# EasyEDA Pro project Remote_Board.eprj

# Schematic Schematic1
Board Name: Board1; Create Date: 2026-01-31; Page Name: P1; Project Name: Remote_Board; Schematic Name: Schematic1; Update Date: 2026-02-01; Company: 嘉立创EDA; Page Size: A4; Version: V1.0
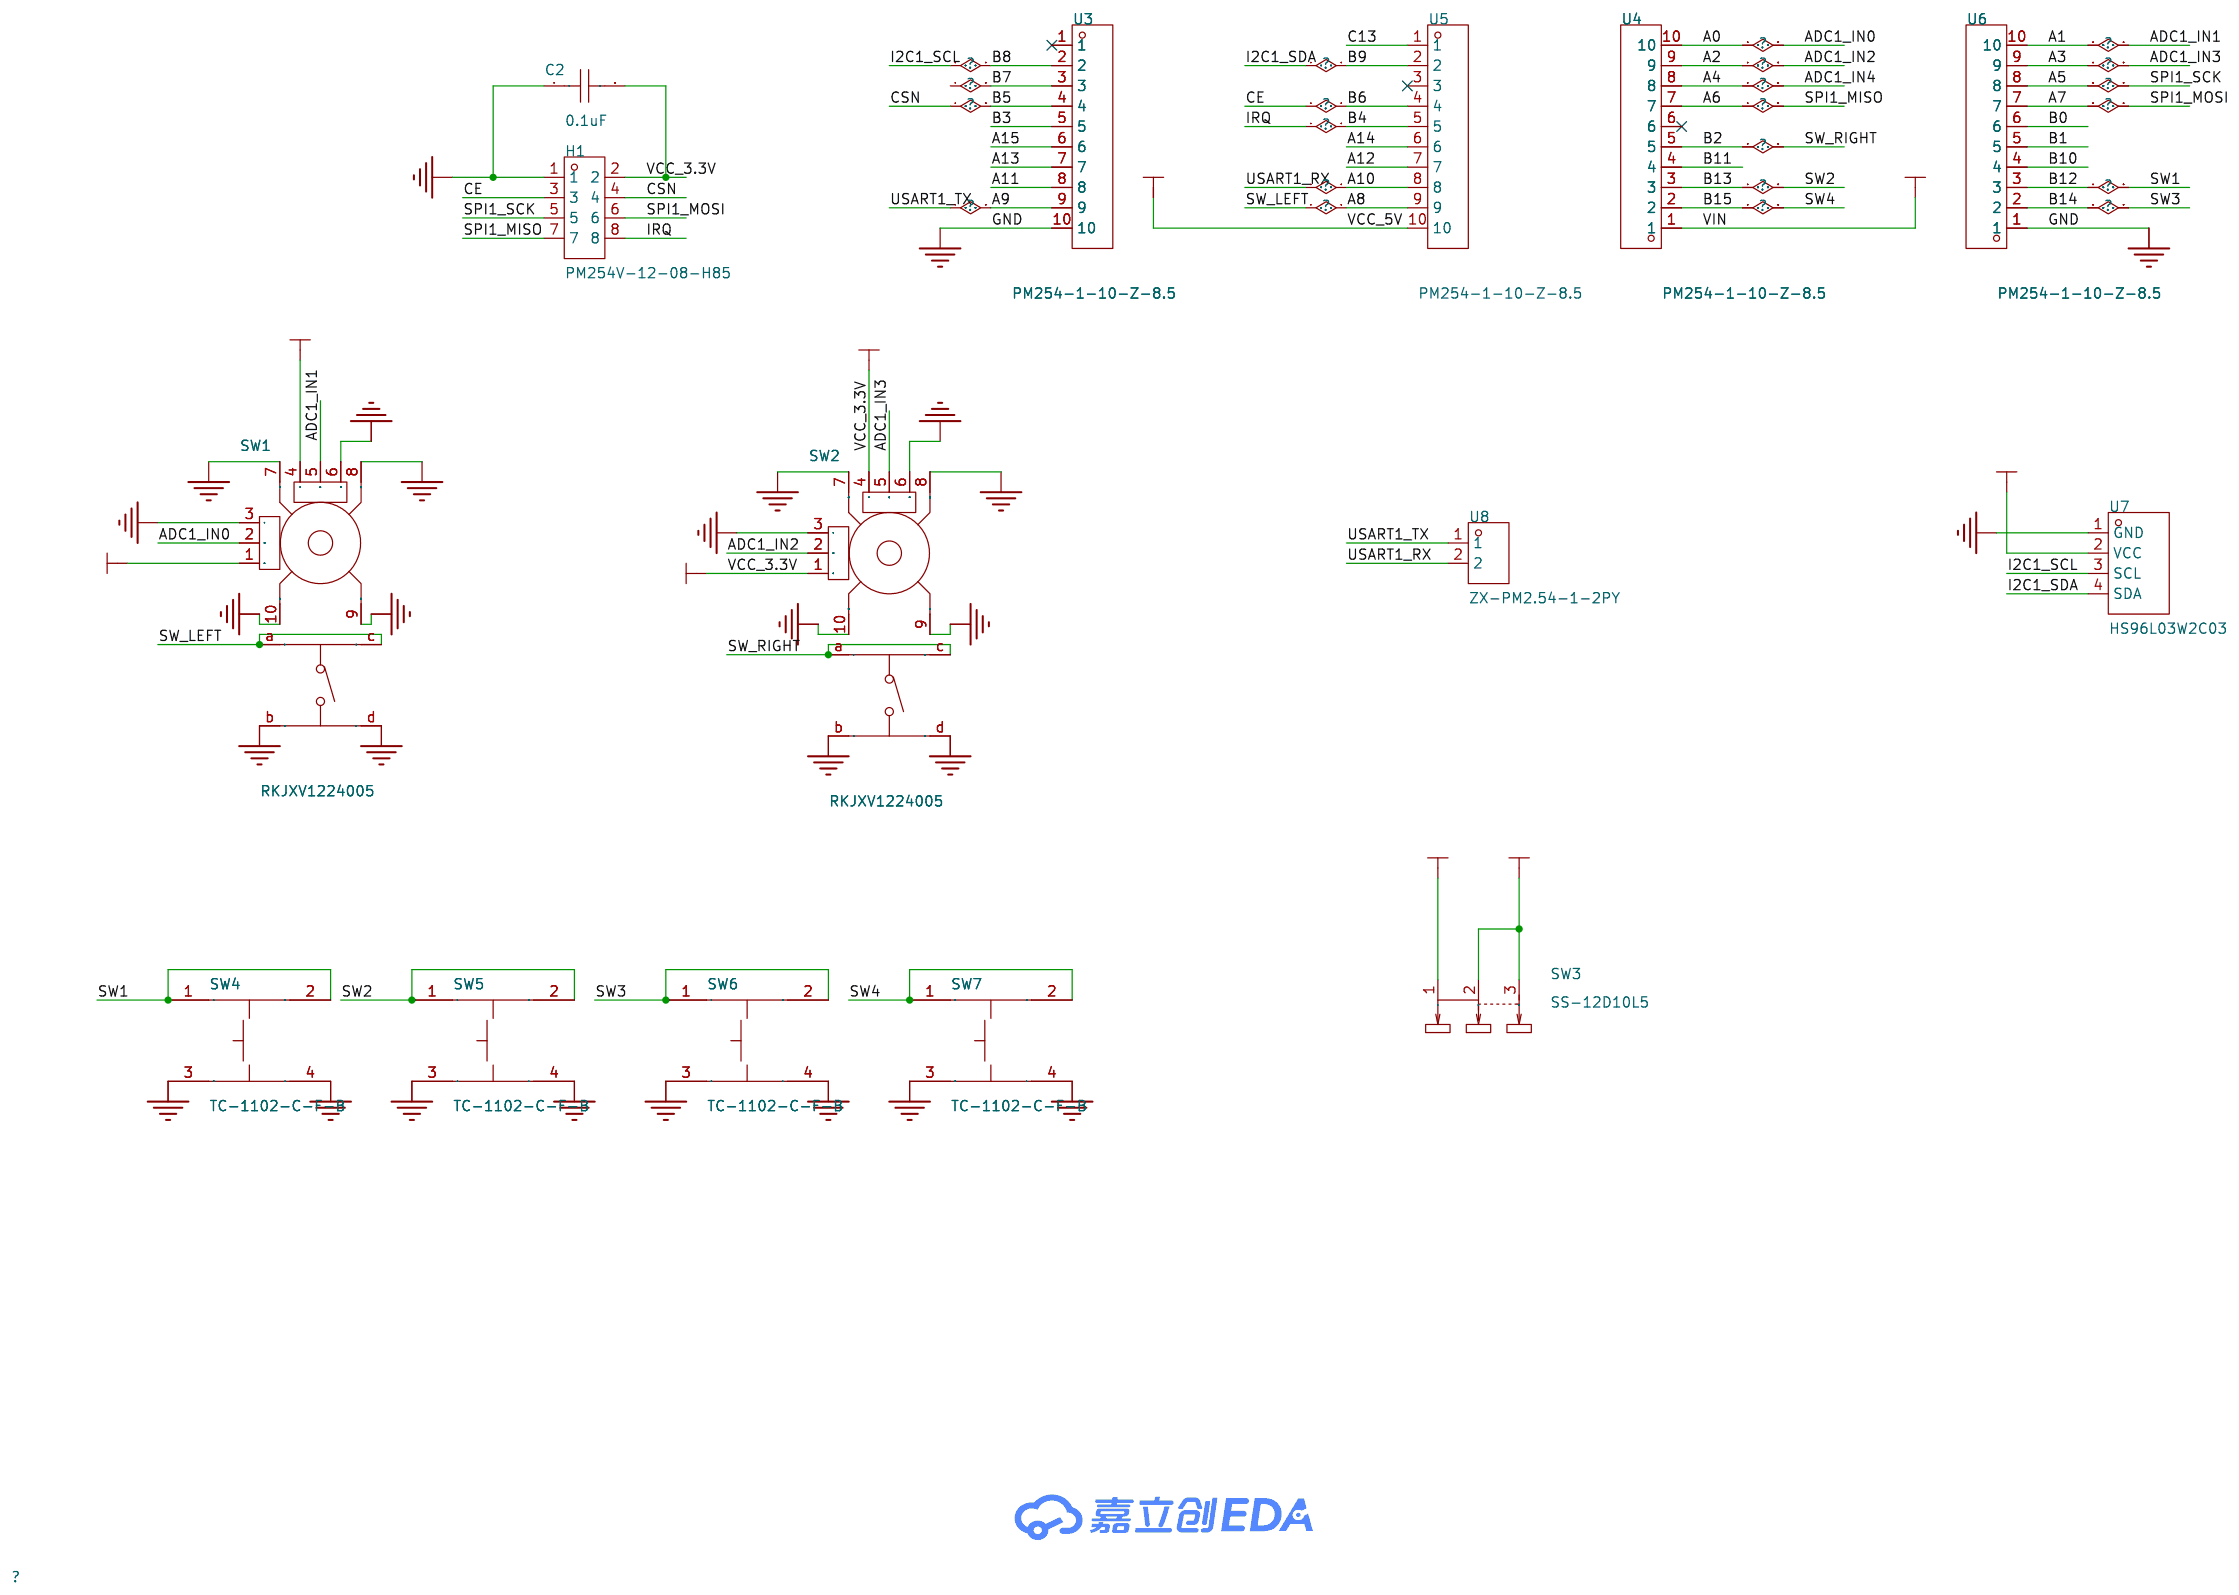
[diagram p0: schematic sheet]

## Parts
C2  0.1uF  [C0805]
H1  PM254V-12-08-H85  [HDR-TH_8P-P2.54-V-F-R2-C4-S2.54]
SW1  RKJXV1224005  [SW-TH_RKJXV1224005]
SW2  RKJXV1224005  [SW-TH_RKJXV1224005]
SW3  SS-12D10L5  [SW-TH_SS-12D10L5]
SW4  TC-1102-C-F-B  [KEY-TH_4P-L6.0-W6.0-P4.50-LS6.5]
SW5  TC-1102-C-F-B  [KEY-TH_4P-L6.0-W6.0-P4.50-LS6.5]
SW6  TC-1102-C-F-B  [KEY-TH_4P-L6.0-W6.0-P4.50-LS6.5]
SW7  TC-1102-C-F-B  [KEY-TH_4P-L6.0-W6.0-P4.50-LS6.5]
U3  PM254-1-10-Z-8.5  [HDR-TH_10P-P2.54-V-F]
U4  PM254-1-10-Z-8.5  [HDR-TH_10P-P2.54-V-F]
U5  PM254-1-10-Z-8.5  [HDR-TH_10P-P2.54-V-F]
U6  PM254-1-10-Z-8.5  [HDR-TH_10P-P2.54-V-F]
U7  HS96L03W2C03  [OLED-TH_L27.8-W27.2-P2.54_C9900033791]
U8  ZX-PM2.54-1-2PY  [HDR-TH_2P-P2.54-V-F]

## Library data of the parts
C2 = CAP_0805: Supplier Footprint: 0805
H1 = PM254V-12-08-H85: LCSC Part Name: 间距:2.54mm 2x4P 直插; Supplier Part: C2834799; Manufacturer: XFCN(兴飞); Supplier Footprint: 插件,P=2.54mm; JLCPCB Part Class: 扩展库; Datasheet: https://item.szlcsc.com/datasheet/PM254V-12-08-H85/2997439.html; Supplier: LCSC; Holes Structure: 2x4P; Pitch: 2.54mm; Row Spacing: 2.54mm; Circular Hole / Square Hole: 方孔; Mounting Type: 直插; Number of Rows: 双排; Number of Positions: 8P; Current Rating: 3A; Voltage Rating (Max): 250V; Holes Direction: 顶部; Insulation Height: 8.5mm; Operating Temperature: -40℃~+105℃
SW1 SW2 = RKJXV1224005: Supplier Part: C146170; Manufacturer: ALPSALPINE(阿尔卑斯阿尔派); Supplier Footprint: 插件,13x13mm; JLCPCB Part Class: 扩展库; Datasheet: https://atta.szlcsc.com/upload/public/pdf/source/20180125/C146170_15168615510911301620.pdf; Supplier: LCSC
SW3 = SS-12D10L5: LCSC Part Name: 柄长5mm 直插双档 滑动开关; Supplier Part: C319012; Manufacturer: XKB Connection(中国星坤); Supplier Footprint: 插件,13x6.8mm; JLCPCB Part Class: 扩展库; Datasheet: https://item.szlcsc.com/datasheet/SS-12D10L5/300104.html; Supplier: LCSC; Circuit: 单刀双掷; Actuator Style: 矩形柱状; Termination Style: PC引脚; Length: 13mm; Width: 6.8mm; Switch Height: 6.4mm; Mounting Type: 直插; Actuator Color: 黑色; Current Rating: 3A; Voltage Rating: 125V; Life: 1万次; Operating Temperature: -40℃~+85℃
SW4-SW7 = TC-1102-C-F-B: LCSC Part Name: 6*6*6.5mm 直插 轻触开关; Supplier Part: C381020; Manufacturer: XKB Connection(中国星坤); Supplier Footprint: 插件-4P,6x6mm; JLCPCB Part Class: 扩展库; Datasheet: https://item.szlcsc.com/datasheet/TC-1102-C-F-B/353252.html; Supplier: LCSC; Circuit: 单刀单掷; Actuator Style: 圆形按钮; Operating Force: 2.6N; Mounting Type: 直插; Length: 6mm; Width: 6mm; Switch Height: 6.5mm; with Bracket: 不带支架; Contact Current: 50mA; Voltage Rating: 12V; Actuator/Cap Color: 黑色; With Lamp: 无; Termination Style: PC引脚; Life: 30万次; Operating Temperature: -30℃~+85℃
U3-U6 = PM254-1-10-Z-8.5: LCSC Part Name: 1x10P 间距:2.54mm 直插; Supplier Part: C2897373; Manufacturer: HCTL(华灿天禄); Supplier Footprint: 插件,P=2.54mm; JLCPCB Part Class: 扩展库; Datasheet: https://item.szlcsc.com/datasheet/PM254-1-10-Z-8.5/3142378.html; Supplier: LCSC; Holes Structure: 1x10P; Pitch: 2.54mm; Circular Hole / Square Hole: 方孔; Mounting Type: 直插; Number of Rows: 单排; Number of Positions: 10P; Current Rating: 3A; Holes Direction: 顶部; Insulation Height: 8.5mm; Contact Material: 铜合金; Operating Temperature: -40℃~+105℃
U7 = HS96L03W2C03: LCSC Part Name: 0.96寸OLED显示屏窄白光IIC; Supplier Part: C5248080; Manufacturer: HS(汉昇); JLCPCB Part Class: 扩展库; Datasheet: https://item.szlcsc.com/datasheet/HS96L03W2C03/5960631.html; Supplier: LCSC; Controller Type: SSD1315芯片; Interface: I2C; Size: 0.96; Dot Pixels: 128x64; Operating Temperature: -40℃~+70℃; Type of Drive: 无源(PMOLED); Display Range: 21.744x10.864mm; Display Color: 白色; Voltage - Supply: 2.8V~3.3V; Luminance: 180cd/m2
U8 = ZX-PM2.54-1-2PY: LCSC Part Name: 1x2P 间距:2.54mm 直插; Supplier Part: C7499322; Manufacturer: Megastar(兆星); Supplier Footprint: 插件,P=2.54mm; JLCPCB Part Class: 扩展库; Datasheet: https://item.szlcsc.com/datasheet/ZX-PM2.54-1-2PY/8573983.html; Supplier: LCSC; Holes Structure: 1x2P; Pitch: 2.54mm; Circular Hole / Square Hole: 方孔; Mounting Type: 直插; Number of Rows: 单排; Number of Positions: 2P; Current Rating: 3A; Holes Direction: 顶部; Insulation Height: 8.5mm; Contact Material: 黄铜; Contact Plating: 金; Operating Temperature: -40℃~+105℃; PIN Length: 3.2mm

## Nets
GND: C2.1 H1.1 SW1.3(A) SW1.6(B) SW1.7(GND) SW1.8(GND) SW1.9(GND) SW1.10(GND) SW1.b SW1.d SW2.3(A) SW2.6(B) SW2.7(GND) SW2.8(GND) SW2.9(GND) SW2.10(GND) SW2.b SW2.d SW4.3 SW4.4 SW5.3 SW5.4 SW6.3 SW6.4 SW7.3 SW7.4 U3.10 U6.1 U7.1(GND)
VCC_3.3V: C2.2 H1.2 SW1.1(B) SW1.4(A) SW2.1(B) SW2.4(A) SW3.1 U7.2(VCC)
VCC_5V: U5.10
VIN: SW3.2 SW3.3 U4.1
A0: SW1.2(DTA) U4.10
A1: SW1.5(DTA) U6.10
A2: SW2.2(DTA) U4.9
A3: SW2.5(DTA) U6.9
A4: U4.8
A5: H1.5 U6.8
A6: H1.7 U4.7
A7: H1.6 U6.7
A8: SW1.a SW1.c U5.9
A9: U3.9 U8.1
A10: U5.8 U8.2
A11: U3.8
A12: U5.7
A13: U3.7
A14: U5.6
A15: U3.6
B0: U6.6
B1: U6.5
B2: SW2.a SW2.c U4.5
B3: U3.5
B4: H1.8 U5.5
B5: H1.4 U3.4
B6: H1.3 U5.4
B7: U3.3
B8: U3.2 U7.3(SCL)
B9: U5.2 U7.4(SDA)
B10: U6.4
B11: U4.4
B12: SW4.1 SW4.2 U6.3
B13: SW5.1 SW5.2 U4.3
B14: SW6.1 SW6.2 U6.2
B15: SW7.1 SW7.2 U4.2
C13: U5.1

Not connected (* = marked no-connect by the designer): U3 1*; U4 6*; U5 3*

# Board PCB1
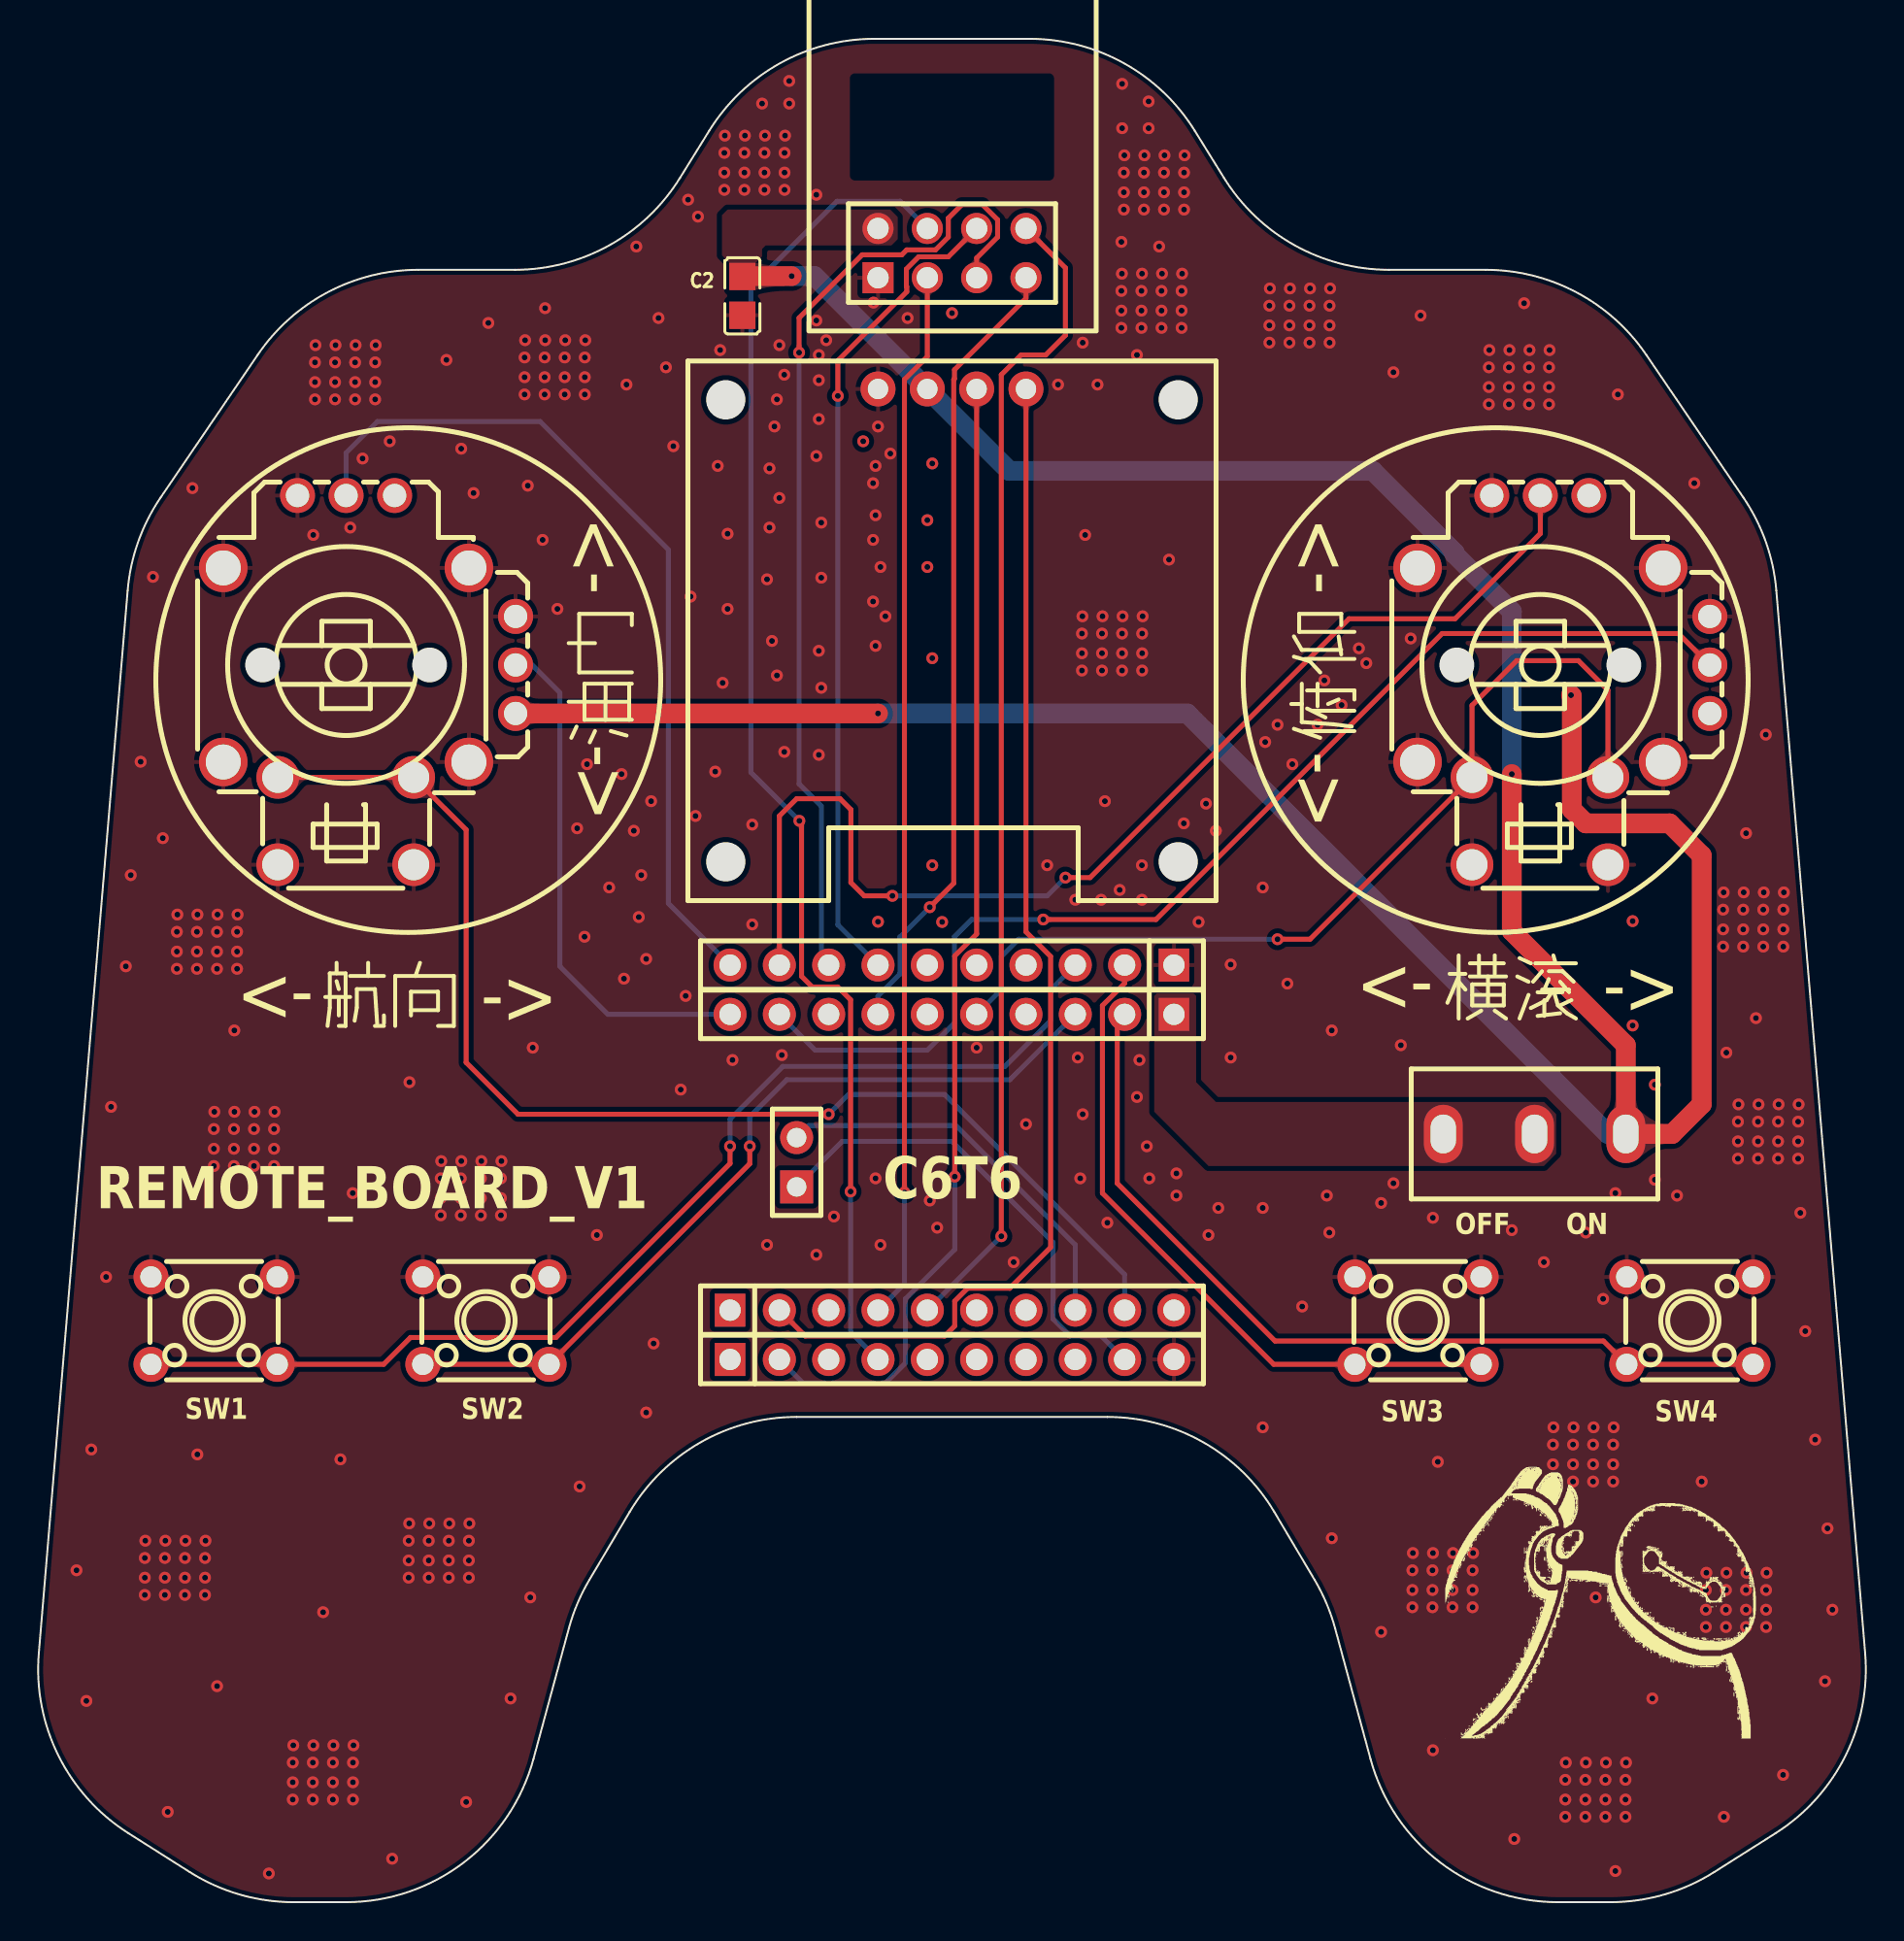
[diagram p1: board, top side]
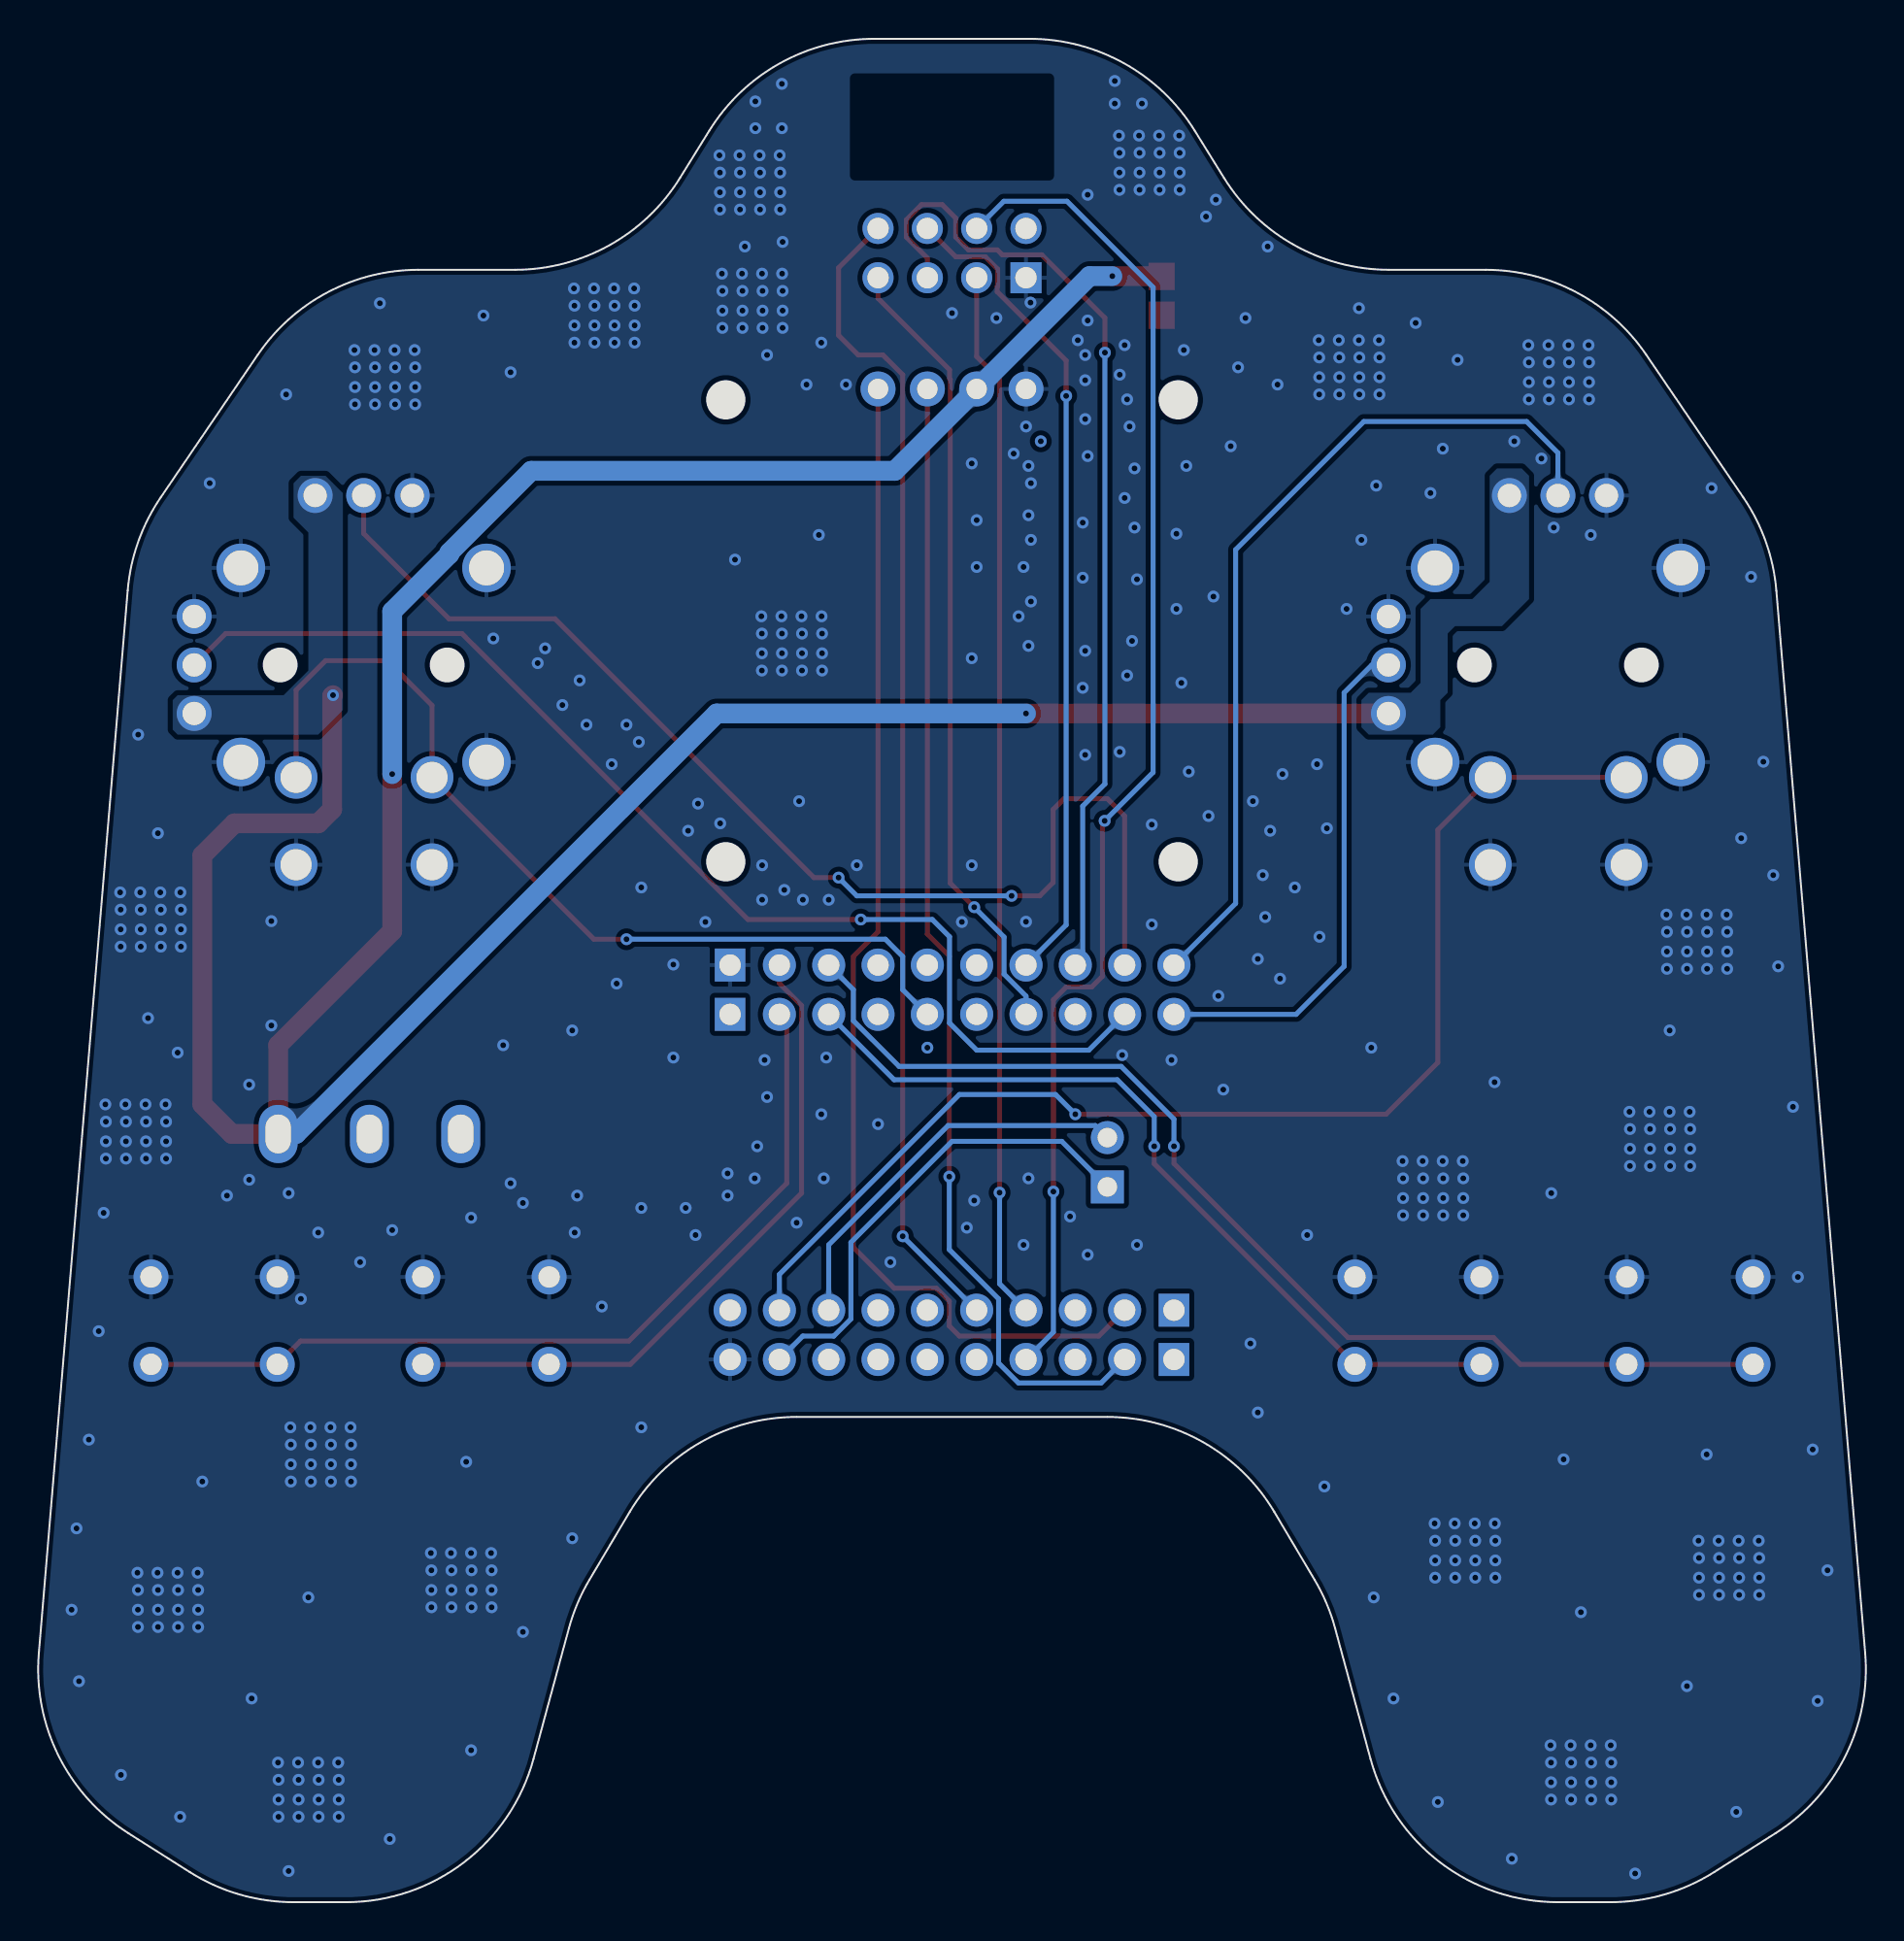
[diagram p2: board, bottom side, seen from below]

Outline 94.05 x 96 mm; copper layers: Top Layer, Bottom Layer. Coordinates in mm from the lower left corner of the outline.
Outline path: 4.57,67.57 0,12.83 arc(1.01,7.55) 4.61,3.55 7.77,1.55 arc(10.34,0.4) 13.12,0 15.82,0 arc(21.9,2.06) 25.47,7.38 27.3,14.12 arc(27.74,15.39) 28.35,16.6 30.42,20.1 arc(34.08,23.69) 39.03,25 55.03,25 arc(59.98,23.69) 63.63,20.1 65.7,16.6 arc(66.31,15.39) 66.75,14.12 68.58,7.38 arc(72.15,2.06) 78.23,0 80.93,0 arc(83.71,0.4) 86.28,1.55 89.44,3.55 arc(93.04,7.55) 94.05,12.83 89.48,67.57 arc(88.94,70.08) 87.78,72.36 82.78,79.72 arc(79.18,82.94) 74.51,84.1 69.53,84.1 arc(64.67,85.36) 61.03,88.83 59.53,91.27 arc(55.89,94.74) 51.03,96 43.03,96 arc(38.16,94.74) 34.53,91.27 33.02,88.83 arc(29.38,85.36) 24.52,84.1 19.54,84.1 arc(14.87,82.94) 11.28,79.72 6.27,72.36 arc(5.11,70.08) 4.57,67.57
Stack: Top Layer 0.035mm / Dielectric1 1.51mm FR4 er 4.5 / Bottom Layer 0.035mm

## Design rules (mm)
template: JLCPCB Capability(Two Layers Board)
spacing copperThickness1oz (default): track to track 0.102, other pairs 0.152 to 0.3
spacing copperThickness2oz: track to track 0.203, other pairs 0.152 to 0.3
track width copperThickness1oz (default): min 0.127, default 0.254, max 2.54
track width copperThickness2oz: min 0.203, default 0.254, max 2.54
differential pair differentialPair (default): width min 0.127, default 0.254, max 2.54; gap min 0.152, default 0.152
via viaSize (default): diameter min 0.5, default 0.61, max 10; hole min 0.3, default 0.305, max 6.3

## Placement (name value [footprint] x y rotation side)
C2  0.1uF  [C0805]  36.23 82.76 90 top
H1  PM254V-12-08-H85  [HDR-TH_8P-P2.54-V-F-R2-C4-S2.54]  47.03 84.96 0 top
SW1  RKJXV1224005  [SW-TH_RKJXV1224005]  17.03 62.96 0 top
SW2  RKJXV1224005  [SW-TH_RKJXV1224005]  78.53 62.96 0 top
SW3  SS-12D10L5  [SW-TH_SS-12D10L5]  77.03 39.58 180 top
SW4  TC-1102-C-F-B  [KEY-TH_4P-L6.0-W6.0-P4.50-LS6.5]  9.03 29.96 0 top
SW5  TC-1102-C-F-B  [KEY-TH_4P-L6.0-W6.0-P4.50-LS6.5]  23.03 29.96 0 top
SW6  TC-1102-C-F-B  [KEY-TH_4P-L6.0-W6.0-P4.50-LS6.5]  71.03 29.96 0 top
SW7  TC-1102-C-F-B  [KEY-TH_4P-L6.0-W6.0-P4.50-LS6.5]  85.03 29.96 0 top
U3  PM254-1-10-Z-8.5  [HDR-TH_10P-P2.54-V-F]  47.03 27.96 0 top
U4  PM254-1-10-Z-8.5  [HDR-TH_10P-P2.54-V-F]  47.03 45.74 180 top
U5  PM254-1-10-Z-8.5  [HDR-TH_10P-P2.54-V-F]  47.03 30.5 0 top
U6  PM254-1-10-Z-8.5  [HDR-TH_10P-P2.54-V-F]  47.03 48.28 180 top
U7  HS96L03W2C03  [OLED-TH_L27.8-W27.2-P2.54_C9900033791]  47.03 77.96 0 top
U8  ZX-PM2.54-1-2PY  [HDR-TH_2P-P2.54-V-F]  39.03 38.12 90 top

## Footprints (pads in the part's own frame, mm; a bottom-side part is the same pattern mirrored in y, then rotated)
C0805
  rect 1.41x1.35 smd: 1(-1,0) 2(1,0)
HDR-TH_2P-P2.54-V-F
  rect 1.7x1.7 hole 1: 1(-1.27,0)
  round 1.7 hole 1: 2(1.27,0)
HDR-TH_8P-P2.54-V-F-R2-C4-S2.54
  rect 1.6x1.6 hole 1.1: 1(-3.81,-1.27)
  round 1.6 hole 1.1: 2(-3.81,1.27) 3(-1.27,-1.27) 4(-1.27,1.27) 5(1.27,-1.27) 6(1.27,1.27) 7(3.81,-1.27) 8(3.81,1.27)
HDR-TH_10P-P2.54-V-F
  rect 1.575x1.7 hole 1.1: 1(-11.43,0)
  round 1.7 hole 1.1: 2(-8.89,0) 3(-6.35,0) 4(-3.81,0) 5(-1.27,0) 6(1.27,0) 7(3.81,0) 8(6.35,0) 9(8.89,0) 10(11.43,0)
KEY-TH_4P-L6.0-W6.0-P4.50-LS6.5
  round 1.8 hole 1.1: 1(-3.251,-2.251) 2(3.251,-2.251) 3(3.251,2.251) 4(-3.251,2.251)
OLED-TH_L27.8-W27.2-P2.54_C9900033791
  round 1.8 hole 1.05: 1(-3.81,0) 2(-1.27,0) 3(1.27,0) 4(3.81,0)
SW-TH_RKJXV1224005
  round 1.8 hole 1.2: 1(7.527,-1.719) 2(7.527,0.781) 3(7.527,3.281) 4(1.298,9.511) 5(-1.202,9.511) 6(-3.703,9.511)
  round 2.5 hole 1.8: 7(-7.527,5.781) 8(-7.527,-4.219) 9(5.122,-4.219) 10(5.122,5.781)
  round 2.2 hole 1.6: a(-4.721,-5.011) b(-4.721,-9.511) c(2.279,-5.011) d(2.279,-9.511)
SW-TH_SS-12D10L5
  oval 2x3 hole 1.3x2: 1(-4.7,0) 2(0,0) 3(4.7,0)

## Nets
As in the schematic.

Pads without a net: U3 1; U4 6; U5 3

## Via types
v1: diameter 0.61, hole 0.305, Top Layer to Bottom Layer, 563 vias

## Routing (per net, layer and track width the routed paths; a pad name or vN(x,y) marks a point on that pad's centre or on a via; arc(x,y) is an arc through that point)
GND:
  vias: v1(1.94,17.1) v1(2.45,10.37) v1(2.7,23.32) v1(3.46,32.21) v1(3.72,40.98) v1(4.48,48.21) v1(4.73,52.91) v1(5.24,58.76) v1(5.46,17.73) v1(5.46,16.72) v1(5.46,15.83) v1(5.48,18.62) v1(5.88,68.28) v1(6.39,54.82) v1(6.52,18.62) v1(6.49,17.73) v1(6.49,16.72) v1(6.49,15.83) v1(6.64,4.65) v1(7.13,50.88) v1(7.11,49.99) v1(7.11,48.98) v1(7.11,48.09) v1(7.55,18.62) v1(7.52,17.73) v1(7.52,16.72) v1(7.52,15.83) v1(7.91,72.85) v1(8.17,50.88) v1(8.14,49.99) v1(8.14,48.98) v1(8.14,48.09) v1(8.16,23.07) v1(8.56,17.73) v1(8.56,16.72) v1(8.56,15.83) v1(8.58,18.62) v1(9.04,40.72) v1(9.01,39.83) v1(9.01,38.82) v1(9.01,37.93) v1(9.17,49.99) v1(9.17,48.98) v1(9.17,48.09) v1(9.2,50.88) v1(9.18,11.13) v1(10.07,44.91) v1(10.07,40.72) v1(10.05,39.83) v1(10.05,38.82) v1(10.05,37.93) v1(10.23,50.88) v1(10.21,49.99) v1(10.21,48.98) v1(10.21,48.09) v1(11.11,40.72) v1(11.08,39.83) v1(11.08,38.82) v1(11.08,37.93) v1(11.85,1.48) v1(12.14,40.72) v1(12.11,39.83) v1(12.11,38.82) v1(12.11,37.93) v1(13.1,8.08) v1(13.08,7.19) v1(13.08,6.18) v1(13.08,5.29) v1(14.13,70.44) v1(14.14,8.08) v1(14.11,7.19) v1(14.11,6.18) v1(14.11,5.29) v1(14.25,80.22) v1(14.22,79.33) v1(14.22,78.31) v1(14.22,77.42) v1(14.64,14.94) v1(15.17,8.08) v1(15.14,7.19) v1(15.14,6.18) v1(15.14,5.29) v1(15.25,79.33) v1(15.25,78.31) v1(15.25,77.42) v1(15.28,80.22) v1(15.53,22.81) v1(16.04,70.82) v1(16.16,36.53) v1(16.2,8.08) v1(16.18,7.19) v1(16.18,6.18) v1(16.18,5.29) v1(16.31,80.22) v1(16.29,79.33) v1(16.29,78.31) v1(16.29,77.42) v1(16.67,74.38) v1(17.35,80.22) v1(17.32,79.33) v1(17.32,78.31) v1(17.32,77.42) v1(18.07,75.27) v1(18.2,2.24) v1(19.07,19.51) v1(19.05,18.62) v1(19.05,17.61) v1(19.05,16.72) v1(19.09,42.25) v1(20.11,19.51) v1(20.08,18.62) v1(20.08,17.61) v1(20.08,16.72) v1(20.72,38.18) v1(20.7,37.29) v1(20.7,36.28) v1(20.7,35.39) v1(20.99,79.46) v1(21.14,19.51) v1(21.11,18.62) v1(21.11,17.61) v1(21.11,16.72) v1(21.75,74.88) v1(21.76,38.18) v1(21.73,37.29) v1(21.73,36.28) v1(21.73,35.39) v1(22.01,5.16) v1(22.17,19.51) v1(22.15,18.62) v1(22.15,17.61) v1(22.15,16.72) v1(22.39,72.6) v1(22.76,37.29) v1(22.76,36.28) v1(22.76,35.39) v1(22.79,38.18) v1(23.15,81.36) v1(23.82,38.18) v1(23.8,37.29) v1(23.8,36.28) v1(23.8,35.39) v1(24.29,10.5) v1(25.04,80.47) v1(25.02,79.58) v1(25.02,78.57) v1(25.02,77.68) v1(25.18,72.98) v1(25.31,15.7) v1(25.44,44.02) v1(25.94,70.19) v1(26.07,82.12) v1(26.07,80.47) v1(26.05,79.58) v1(26.05,78.57) v1(26.05,77.68) v1(26.71,66.63) v1(27.11,80.47) v1(27.08,79.58) v1(27.08,78.57) v1(27.08,77.68) v1(27.72,55.33) v1(27.85,21.42) v1(28.14,80.47) v1(28.12,79.58) v1(28.12,78.57) v1(28.12,77.68) v1(28.1,49.74) v1(28.23,58.63) v1(28.74,34.37) v1(29.37,52.28) v1(30.01,58.12) v1(30.13,47.58) v1(30.26,78.19) v1(30.64,55.2) v1(30.77,85.3) v1(30.9,50.75) v1(31.02,52.91) v1(31.28,48.6) v1(31.28,25.23) v1(31.53,56.72) v1(31.66,28.78) v1(31.91,81.62) v1(32.29,79.08) v1(32.67,75.01) v1(33.06,41.86) v1(33.31,46.69) v1(33.44,87.71) v1(33.56,67.26) v1(33.82,55.96) v1(33.94,86.84) v1(34.83,58.25) v1(34.96,74) v1(35.09,79.96) v1(35.21,62.82) v1(35.33,91.01) v1(35.3,90.12) v1(35.3,89.11) v1(35.3,88.22) v1(35.47,70.5) v1(35.47,66.63) v1(35.72,43.39) v1(36.36,91.01) v1(36.34,90.12) v1(36.34,89.11) v1(36.34,88.22) v1(36.74,55.52) v1(36.74,50.37) v1(37.25,92.66) v1(37.37,90.12) v1(37.37,89.11) v1(37.37,88.22) v1(37.39,91.01) v1(37.5,68.15) v1(37.5,33.86) v1(37.63,73.87) v1(37.63,70.82) v1(37.75,64.98) v1(37.88,76.03) v1(38.01,77.42) v1(38.01,63.2) v1(38.14,80.22) v1(38.14,72.34) v1(38.26,43.64) v1(38.43,91.01) v1(38.4,90.12) v1(38.4,89.11) v1(38.4,88.22) v1(38.39,78.69) v1(38.39,59.26) v1(38.64,93.83) v1(38.64,92.66) v1(40.04,87.97) v1(40.04,81.49) v1(40.04,74.5) v1(40.04,33.36) v1(40.17,79.71) v1(40.17,78.41) v1(40.17,76.41) v1(40.17,64.47) v1(40.17,59.11) v1(40.29,71.07) v1(40.29,68.24) v1(40.29,62.57) v1(40.55,80.47) v1(40.95,35.33) v1(42.96,73.11) v1(42.96,70.19) v1(42.96,67.01) v1(42.98,82.41) v1(43.09,74) v1(43.09,71.46) v1(43.09,64.72) v1(43.09,37.29) v1(43.22,76.03) v1(43.22,50.51) v1(43.34,68.79) v1(43.34,33.86) v1(43.6,66.25) v1(43.85,74.63) v1(44.74,81.62) v1(45.76,71.2) v1(45.76,68.79) v1(45.88,36.15) v1(46.01,74.12) v1(46.01,64.09) v1(46.01,53.42) v1(46.26,34.75) v1(46.52,50.5) v1(47.03,81.87) v1(48.3,44.02) v1(50.2,32.97) v1(50.84,40.09) v1(51.93,53.42) v1(52.49,78.19) v1(53.38,51.64) v1(53.5,43.52) v1(53.63,37.29) v1(53.76,80.35) v1(53.74,66.25) v1(53.72,65.36) v1(53.72,64.34) v1(53.72,63.45) v1(53.76,40.59) v1(53.88,70.44) v1(54.52,78.19) v1(54.75,65.36) v1(54.75,64.34) v1(54.75,63.45) v1(54.71,51.64) v1(54.78,66.25) v1(54.9,56.72) v1(55.03,35.01) v1(55.66,52.15) v1(55.75,85.54) v1(55.75,83.01) v1(55.75,82) v1(55.75,81.11) v1(55.79,93.68) v1(55.79,91.39) v1(55.78,83.9) v1(55.81,66.25) v1(55.78,65.36) v1(55.78,64.34) v1(55.78,63.45) v1(55.9,90) v1(55.88,89.11) v1(55.88,88.09) v1(55.88,87.2) v1(56.55,79.71) v1(56.55,41.48) v1(56.68,43.39) v1(56.81,83.9) v1(56.78,83.01) v1(56.78,82) v1(56.78,81.11) v1(56.84,66.25) v1(56.82,65.36) v1(56.82,64.34) v1(56.82,63.45) v1(56.8,53.42) v1(56.8,51.64) v1(56.94,90) v1(56.91,89.11) v1(56.91,88.09) v1(56.91,87.2) v1(57.06,38.94) v1(57.15,92.78) v1(57.15,91.39) v1(57.19,37.29) v1(57.69,85.3) v1(57.84,83.9) v1(57.82,83.01) v1(57.82,82) v1(57.82,81.11) v1(57.97,90) v1(57.94,89.11) v1(57.94,88.09) v1(57.94,87.2) v1(58.2,69.17) v1(58.58,37.55) v1(58.58,36.4) v1(58.88,83.9) v1(58.85,83.01) v1(58.85,82) v1(58.85,81.11) v1(58.96,55.58) v1(59,90) v1(58.98,89.11) v1(58.98,88.09) v1(58.98,87.2) v1(59.73,50.5) v1(60.11,56.6) v1(60.23,34.37) v1(60.61,55.2) v1(60.74,35.77) v1(61.38,48.31) v1(61.38,43.52) v1(63.03,52.28) v1(63.03,35.77) v1(63.03,24.47) v1(63.15,59.77) v1(63.37,82.25) v1(63.37,81.23) v1(63.37,80.35) v1(63.4,83.14) v1(63.79,60.66) v1(64.3,47.33) v1(64.43,83.14) v1(64.4,82.25) v1(64.4,81.23) v1(64.4,80.35) v1(64.55,58.63) v1(65.06,30.69) v1(65.46,83.14) v1(65.44,82.25) v1(65.44,81.23) v1(65.44,80.35) v1(65.85,60.66) v1(66.2,62.95) v1(66.33,36.4) v1(66.47,82.25) v1(66.47,81.23) v1(66.47,80.35) v1(66.46,34.5) v1(66.5,83.14) v1(66.58,44.91) v1(66.58,18.75) v1(67.09,61.68) v1(67.98,64.6) v1(68.36,63.84) v1(69.12,36.02) v1(69.12,13.92) v1(69.76,78.82) v1(69.76,37.04) v1(70.14,44.15) v1(70.65,65.11) v1(70.76,17.99) v1(70.74,17.1) v1(70.74,16.08) v1(70.74,15.19) v1(71.16,81.74) v1(71.77,17.1) v1(71.77,16.08) v1(71.77,15.19) v1(71.79,35.26) v1(71.79,17.99) v1(71.79,7.83) v1(72.04,22.69) v1(72.83,17.99) v1(72.8,17.1) v1(72.8,16.08) v1(72.8,15.19) v1(73.86,17.99) v1(73.84,17.1) v1(73.84,16.08) v1(73.84,15.19) v1(74.67,79.08) v1(74.67,78.06) v1(74.67,77.17) v1(74.7,79.96) v1(75.73,79.96) v1(75.71,79.08) v1(75.71,78.06) v1(75.71,77.17) v1(75.85,34.63) v1(75.98,3.26) v1(76.49,82.38) v1(76.76,79.96) v1(76.74,79.08) v1(76.74,78.06) v1(76.74,77.17) v1(77.51,32.97) v1(77.77,79.08) v1(77.77,78.06) v1(77.77,77.17) v1(77.8,79.96) v1(77.97,23.58) v1(77.97,22.56) v1(77.97,21.67) v1(78,24.47) v1(78.64,7.19) v1(78.61,6.3) v1(78.61,5.29) v1(78.61,4.4) v1(79.03,24.47) v1(79.01,23.58) v1(79.01,22.56) v1(79.01,21.67) v1(79.66,34.5) v1(79.67,7.19) v1(79.64,6.3) v1(79.64,5.29) v1(79.64,4.4) v1(80.07,24.47) v1(80.04,23.58) v1(80.04,22.56) v1(80.04,21.67) v1(80.17,15.7) v1(80.56,31.08) v1(80.7,7.19) v1(80.68,6.3) v1(80.68,5.29) v1(80.68,4.4) v1(81.07,23.58) v1(81.07,22.56) v1(81.07,21.67) v1(81.1,24.47) v1(81.19,36.53) v1(81.19,1.61) v1(81.32,77.68) v1(81.74,7.19) v1(81.71,6.3) v1(81.71,5.29) v1(81.71,4.4) v1(82.08,50.54) v1(82.08,45.17) v1(83.09,10.5) v1(83.22,42.12) v1(83.22,37.22) v1(84.36,36.4) v1(85.25,73.11) v1(85.63,21.67) v1(85.87,16.97) v1(85.85,16.08) v1(85.85,15.07) v1(85.85,14.18) v1(86.76,52.02) v1(86.74,51.14) v1(86.74,50.12) v1(86.74,49.23) v1(86.78,4.4) v1(86.9,43.77) v1(86.91,16.97) v1(86.88,16.08) v1(86.88,15.07) v1(86.88,14.18) v1(87.53,41.1) v1(87.5,40.21) v1(87.5,39.2) v1(87.5,38.31) v1(87.77,51.14) v1(87.77,50.12) v1(87.77,49.23) v1(87.8,52.02) v1(87.92,55.07) v1(87.94,16.97) v1(87.91,16.08) v1(87.91,15.07) v1(87.91,14.18) v1(88.43,45.55) v1(88.56,41.1) v1(88.53,40.21) v1(88.53,39.2) v1(88.53,38.31) v1(88.83,52.02) v1(88.8,51.14) v1(88.8,50.12) v1(88.8,49.23) v1(88.94,60.15) v1(88.97,16.97) v1(88.95,16.08) v1(88.95,15.07) v1(88.95,14.18) v1(89.57,40.21) v1(89.57,39.2) v1(89.57,38.31) v1(89.59,41.1) v1(89.86,52.02) v1(89.84,51.14) v1(89.84,50.12) v1(89.84,49.23) v1(89.82,6.56) v1(90.63,41.1) v1(90.6,40.21) v1(90.6,39.2) v1(90.6,38.31) v1(90.71,35.51) v1(90.97,29.42) v1(91.48,23.83) v1(91.98,11.38) v1(92.11,19.26) v1(92.36,15.07)
VCC_3.3V: length 173.3
  Top Layer w1.016: C2.2 36.25,83.77 v1(38.77,83.77) ; v1(75.85,58.12) 75.85,50.02 81.73,44.15 SW3.1 84.11,39.58 85.63,41.1 85.63,53.93 83.98,55.58 79.66,55.58 78.95,56.3 78.95,62.14 v1(78.9,62.18) ; SW1.1 v1(43.22,61.24)
  Bottom Layer w1.016: SW3.1 80.81,39.58 59.14,61.24 v1(43.22,61.24) ; v1(38.77,83.77) 39.94,83.77 U7.2 49.97,73.74 68.7,73.74 72.91,69.53 72.91,69.45 75.85,66.5 v1(75.85,58.12)
(no net):
  vias: v1(42.45,75.27)
A0: length 26.8
  Bottom Layer w0.254: SW1.2 25.4,63.74 26.83,62.31 26.83,48.21 29.31,45.74 U4.10
A1: length 44.9
  Bottom Layer w0.254: SW1.5 15.82,74.67 17.43,76.28 25.82,76.28 32.42,69.68 32.42,51.46 U6.10
A2: length 60.8
  Top Layer w0.254: SW2.2 84.43,65.36 72.27,65.36 57.53,50.63 v1(51.72,50.63)
  Bottom Layer w0.254: v1(51.72,50.63) 48.04,50.63 47.15,49.74 47.15,45.29 45.76,43.9 39.98,43.9 U4.9
A3: length 61.2
  Top Layer w0.254: v1(43.96,51.85) 42.5,51.85 41.82,52.53 41.82,56.29 41.26,56.85 39.02,56.85 38.14,55.96 U6.9 ; v1(52.87,52.79) 54.14,52.79 67.47,66.12 72.93,66.12 77.32,70.51 SW2.5
  Bottom Layer w0.254: v1(52.87,52.79) 51.93,51.85 v1(43.96,51.85)
A5: length 50.9
  Top Layer w0.254: H1.5 48.3,84.7 49.37,85.78 49.37,86.68 48.59,87.46 47.53,87.46 46.83,86.76 46.83,85.78 46.18,85.13 44.69,85.13 44.44,84.87 42.4,84.87 39.15,81.62 v1(39.15,79.83)
  Bottom Layer w0.254: v1(39.15,79.83) 39.15,57.61 40.29,56.47 40.29,48.66 U6.8
A6: length 41.1
  Top Layer w0.254: v1(45.88,51.26) 47.12,52.5 47.12,78.45 47.15,78.48 47.15,78.95 50.84,82.63 H1.7
  Bottom Layer w0.254: U4.7 43.22,46.68 44.34,47.81 44.34,49.72 v1(45.88,51.26)
A7: length 42.7
  Top Layer w0.254: v1(41.15,77.6) 41.15,79.42 44.7,82.97 44.7,83.22 44.68,83.24 44.68,84.14 45.31,84.77 46.83,84.77 H1.6
  Bottom Layer w0.254: U6.7 41.15,50.35 v1(41.15,77.6)
A8: length 63.9
  Top Layer w0.254: SW1.a SW1.c 22.01,55.25 22.01,43.26 24.67,40.59 v1(40.68,40.59)
  Bottom Layer w0.254: U5.9 55.92,32.34 46.64,41.61 41.69,41.61 v1(40.68,40.59)
A9: length 24.8
  Bottom Layer w0.254: U3.9 54.71,29.16 53.11,29.16 52.23,30.05 52.23,33.99 47.03,39.2 41.37,39.2 U8.1
A10: length 20.5
  Bottom Layer w0.254: U5.8 53.38,33.86 47.23,40.01 39.65,40.01 U8.2
B2: length 48.4
  Top Layer w0.254: v1(63.79,49.61) 65.47,49.61 SW2.a 73.8,61.66 76.11,63.96 79.28,63.96 80.8,62.44 SW2.c
  Bottom Layer w0.254: v1(63.79,49.61) 50.45,49.61 49.57,48.72 49.57,47.01 U4.5
B4: length 60.3
  Top Layer w0.254: v1(49.57,34.31) 49.57,78.69 50.58,79.71 51.85,79.71 52.87,80.73 52.87,84.2 H1.8
  Bottom Layer w0.254: U5.5 v1(49.57,34.31)
B5: length 70.2
  Top Layer w0.254: v1(39.17,55.71) 39.28,55.6 39.28,47.7 39.83,47.15 41.14,47.15 41.8,46.49 v1(41.8,36.61)
  Bottom Layer w0.254: v1(39.17,55.71) 36.67,58.21 36.67,83.2 41.1,87.63 44.36,87.63 45.76,86.23 ; v1(41.8,36.61) 41.8,29.37 U3.4
B6: length 54.2
  Top Layer w0.254: v1(44.58,36.56) 44.58,78.45 45.76,79.63 H1.3
  Bottom Layer w0.254: v1(44.58,36.56) 44.58,31.86 U5.4
B8: length 59.1
  Top Layer w0.254: U7.3 48.3,49.88 47.17,48.75 v1(47.17,37.38)
  Bottom Layer w0.254: U3.2 39.34,26.75 43.6,26.75 44.63,27.77 44.63,31.08 47.17,33.62 v1(47.17,37.38)
B9: length 61.9
  Top Layer w0.254: U5.2 39.47,29.16 46.64,29.16 47.17,29.69 47.17,30.97 47.83,31.63 50,31.63 52.11,33.74 52.11,48.72 50.84,49.99 U7.4
B12: length 58.4
  Top Layer w0.254: v1(35.6,38.94) 35.6,38.05 26.63,29.09 19.14,29.09 17.76,27.71 SW4.2 SW4.1
  Bottom Layer w0.254: U6.3 52.11,47.01 52.11,45.41 49.75,43.06 38.31,43.06 35.6,40.34 v1(35.6,38.94)
B13: length 42.5
  Top Layer w0.254: SW5.1 SW5.2 36.61,38.04 v1(36.61,38.94)
  Bottom Layer w0.254: U4.3 50.01,42.37 38.52,42.37 36.61,40.47 v1(36.61,38.94)
B14: length 35.4
  Top Layer w0.254: U6.2 55.92,47.34 54.77,46.19 54.77,36.53 63.59,27.71 SW6.1 SW6.2
B15: length 45.5
  Top Layer w0.254: SW7.2 SW7.1 80.57,28.91 63.66,28.91 55.53,37.04 55.53,45.36 U4.2

## Copper pours and planes (outline as drawn; the poured copper is in the pictures)
GND on Top Layer: -1.87,100.03 99.22,100.03 99.22,-2.33 -1.87,-2.33
GND on Bottom Layer: -1.49,99.52 98.84,99.52 98.84,-1.82 -1.49,-1.82
VCC_3.3V on Top Layer: 35.17,87.2 44.23,87.2 44.23,84.16 35.17,84.16
VCC_3.3V on Bottom Layer: 17.31,73.87 25.94,73.87 25.94,60.15 17.31,60.15
VCC_3.3V on Bottom Layer: 78.39,73.49 87.16,73.49 87.16,60.15 78.39,60.15
VIN on Top Layer: 57.44,46.82 78.14,46.82 78.14,37.93 57.44,37.93

Small or netless copper shapes (teardrops, artwork), in the pictures only: 49 on Top Layer, 38 on Bottom Layer

## Text on the board
Top Silkscreen Layer: SW1 | SW2 | SW3 | OFF | ON | SW4 | REMOTE_BOARD_V1 | C6T6 | -> | 航向 | 横滚 | 油门 | 俯仰
